# EAGLE design Adafruit AirLift Shield (EAGLE 9.3.2)
COMPANY: ADAFRUIT INDUSTRIES; DRAWN: KTOWN; REV: B
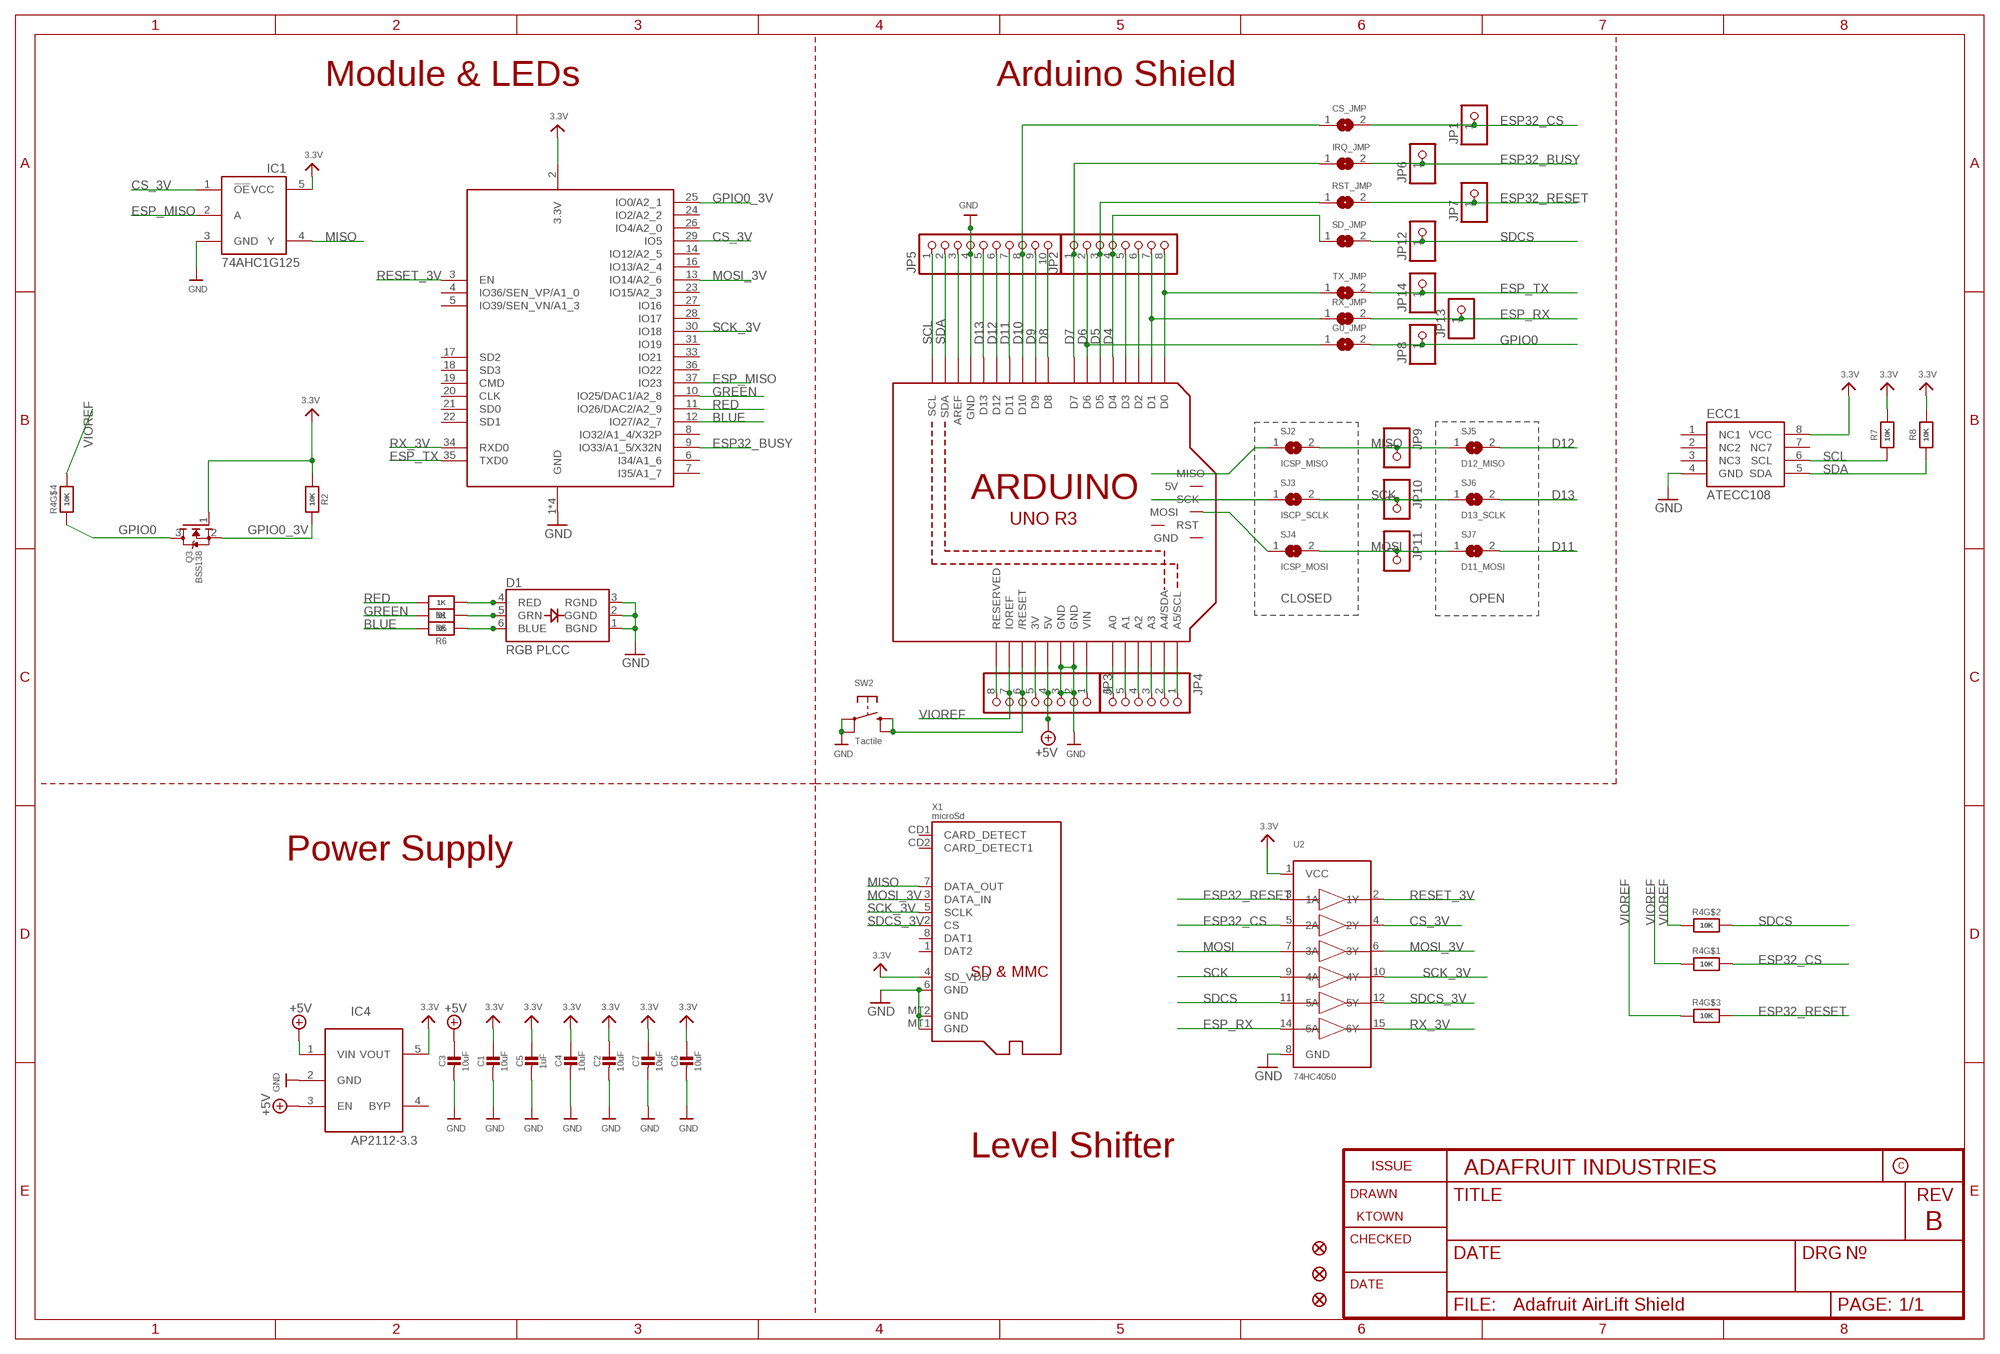
[diagram p0: schematic, sheet 1]

## Parts
C1  10uF  CAP_CERAMIC0805-NOOUTLINE  [0805-NO]
C2  10uF  CAP_CERAMIC0805-NOOUTLINE  [0805-NO]
C3  10uF  CAP_CERAMIC0805-NOOUTLINE  [0805-NO]
C4  10uF  CAP_CERAMIC0805-NOOUTLINE  [0805-NO]
C5  1uF  CAP_CERAMIC0805-NOOUTLINE  [0805-NO]
C6  10uF  CAP_CERAMIC0805-NOOUTLINE  [0805-NO]
C7  10uF  CAP_CERAMIC0805-NOOUTLINE  [0805-NO]
CS_JMP  SOLDERJUMPERCLOSED  [SOLDERJUMPER_CLOSEDWIRE]
D1  RGB PLCC  LED_RGB_PLCC6_3535  [RGBLED_3535_PLCC6]
ECC1  ATECC108  [SOIC8]
FID1  FIDUCIAL_1MM  [FIDUCIAL_1MM]
FID2  FIDUCIAL_1MM  [FIDUCIAL_1MM]
FID3  FIDUCIAL_1MM  [FIDUCIAL_1MM]
G0_JMP  SOLDERJUMPER  [SOLDERJUMPER_ARROW_NOPASTE]
IC1  74AHC1G125  [SOT23-5L]
IC4  AP2112-3.3  LP298XS  [SOT23-5L]
IRQ_JMP  SOLDERJUMPERCLOSED  [SOLDERJUMPER_CLOSEDWIRE]
JP1  HEADER-1X1ROUND  [1X01_ROUND]
JP2  HEADER-1X870MIL  [1X08_ROUND_70]
JP3  HEADER-1X870MIL  [1X08_ROUND_70]
JP4  HEADER-1X670MIL  [1X06_ROUND_70]
JP5  HEADER-1X1070MIL  [1X10_ROUND70]
JP6  HEADER-1X1ROUND  [1X01_ROUND]
JP7  HEADER-1X1ROUND  [1X01_ROUND]
JP8  HEADER-1X1ROUND  [1X01_ROUND]
JP9  HEADER-1X1ROUND  [1X01_ROUND]
JP10  HEADER-1X1ROUND  [1X01_ROUND]
JP11  HEADER-1X1ROUND  [1X01_ROUND]
JP12  HEADER-1X1ROUND  [1X01_ROUND]
JP13  HEADER-1X1ROUND  [1X01_ROUND]
JP14  HEADER-1X1ROUND  [1X01_ROUND]
M1  ARDUINO_R3_ICSP_NODIM  [ARDUINOR3_ICSP_NODIM]
Q3  BSS138  MOSFET-NWIDE  [SOT23-WIDE]
R1  1K  RESISTOR_0603_NOOUT  [0603-NO]
R2  10K  RESISTOR_0603_NOOUT  [0603-NO]
R4  10K  RESISTOR_4PACK  [RESPACK_4X0603]
R5  1K  RESISTOR_0603_NOOUT  [0603-NO]
R6  1K  RESISTOR_0603_NOOUT  [0603-NO]
R7  10K  RESISTOR_0603_NOOUT  [0603-NO]
R8  10K  RESISTOR_0603_NOOUT  [0603-NO]
RST_JMP  SOLDERJUMPERCLOSED  [SOLDERJUMPER_CLOSEDWIRE]
RX_JMP  SOLDERJUMPER  [SOLDERJUMPER_ARROW_NOPASTE]
SD_JMP  SOLDERJUMPERCLOSED  [SOLDERJUMPER_CLOSEDWIRE]
SJ2  ICSP_MISO  SOLDERJUMPERCLOSED  [SOLDERJUMPER_CLOSEDWIRE]
SJ3  ISCP_SCLK  SOLDERJUMPERCLOSED  [SOLDERJUMPER_CLOSEDWIRE]
SJ4  ICSP_MOSI  SOLDERJUMPERCLOSED  [SOLDERJUMPER_CLOSEDWIRE]
SJ5  D12_MISO  SOLDERJUMPERREFLOW_NOPASTE  [SOLDERJUMPER_REFLOW_NOPASTE]
SJ6  D13_SCLK  SOLDERJUMPERREFLOW_NOPASTE  [SOLDERJUMPER_REFLOW_NOPASTE]
SJ7  D11_MOSI  SOLDERJUMPERREFLOW_NOPASTE  [SOLDERJUMPER_REFLOW_NOPASTE]
SW2  Tactile  SWITCH_TACT_SMT_EVQQ2_SMALL  [EVQ-Q2_SMALLER]
TX_JMP  SOLDERJUMPER  [SOLDERJUMPER_ARROW_NOPASTE]
U2  74HC4050  74HC4050D  [SOIC16]
X1  microSd  MICROSD  [MICROSD]
X2  ESP32_WROOM32  [WROOM32]

## Nets
3.3V: C1.1 C2.1 C4.1 C5.1 C6.1 C7.1 ECC1.8(VCC) IC1.5(VCC) IC4.5(VOUT) Q3.1(G) R2.1 R7.2 R8.2 U2.1(VCC) X1.4(SD_VDD) X2.2(3.3V)
+3V: JP3.5 M1.3V
+5V: C3.1 IC4.1(VIN) IC4.3(EN) JP3.4 M1.5V
A0: JP4.6 M1.A0
A1: JP4.5 M1.A1
A2: JP4.4 M1.A2
A3: JP4.3 M1.A3
A4: JP4.2 M1.A4(A4/SDA)
A5: JP4.1 M1.A5(A5/SCL)
AREF: JP5.3 M1.AREF
BLUE: R6.2 X2.12(IO27/A2_7)
CS_3V: IC1.1(!OE) U2.4(2Y) X2.29(IO5)
D0: JP2.8 M1.D0 TX_JMP.1
D1: JP2.7 M1.D1 RX_JMP.1
D2: JP2.6 M1.D2
D3: JP2.5 M1.D3
D4: JP2.4 M1.D4 SD_JMP.1
D5: JP2.3 M1.D5 RST_JMP.1
D6: G0_JMP.1 JP2.2 M1.D6
D7: IRQ_JMP.1 JP2.1 M1.D7
D8: JP5.10 M1.D8
D9: JP5.9 M1.D9
D10: CS_JMP.1 JP5.8 M1.D10
D11: JP5.7 M1.D11 SJ7.2
D12: JP5.6 M1.D12 SJ5.2
D13: JP5.5 M1.D13 SJ6.2
ESP32_BUSY: IRQ_JMP.2 JP6.1 X2.9(IO33/A1_5/X32N)
ESP32_CS: CS_JMP.2 JP1.1 R4.8 U2.5(2A)
ESP32_RESET: JP7.1 R4.6 RST_JMP.2 U2.3(1A)
ESP_MISO: IC1.2(A) X2.37(IO23)
ESP_RX: JP13.1 RX_JMP.2 U2.14(6A)
ESP_TX: JP14.1 TX_JMP.2 X2.35(TXD0)
GND: C1.2 C2.2 C3.2 C4.2 C5.2 C6.2 C7.2 D1.1(BGND) D1.2(GGND) D1.3(RGND) ECC1.4(GND) IC1.3(GND) IC4.2(GND) JP3.2 JP3.3 JP5.4 M1.GND M1.GND@1(GND) M1.GND@3(GND) SW2.A'(P1) SW2.A(P) U2.8(GND) X1.6(GND) X1.MT1(GND) X1.MT2(GND) X2.1(GND) X2.15(GND) X2.38(GND) X2.P$1(GND)
GPIO0: G0_JMP.2 JP8.1 Q3.3(D) R4.4
GPIO0_3V: Q3.2(S) R2.2 X2.25(IO0/A2_1)
GREEN: R5.2 X2.10(IO25/DAC1/A2_8)
MISO: IC1.4(Y) JP9.1 SJ2.2 SJ5.1 X1.7(DATA_OUT)
MISO_ICSP: M1.MISO SJ2.1
MOSI: JP11.1 SJ4.2 SJ7.1 U2.7(3A)
MOSI_3V: U2.6(3Y) X1.3(DATA_IN) X2.13(IO14/A2_6)
MOSI_ICSP: M1.MOSI SJ4.1
N$8: D1.4(RED) R1.1
N$11: D1.5(GRN) R5.1
N$14: D1.6(BLUE) R6.1
NC: JP3.8 M1.RESERVED
RED: R1.2 X2.11(IO26/DAC2/A2_9)
RESET: JP3.6 M1.RESET(/RESET) SW2.B'(S1) SW2.B(S)
RESET_3V: U2.2(1Y) X2.3(EN)
RX_3V: U2.15(6Y) X2.34(RXD0)
SCK: JP10.1 SJ3.2 SJ6.1 U2.9(4A)
SCK_3V: U2.10(4Y) X1.5(SCLK) X2.30(IO18)
SCK_ICSP: M1.SCK SJ3.1
SCL: ECC1.6(SCL) JP5.1 M1.SCL R7.1
SDA: ECC1.5(SDA) JP5.2 M1.SDA R8.1
SDCS: JP12.1 R4.7 SD_JMP.2 U2.11(5A)
SDCS_3V: U2.12(5Y) X1.2(CS)
VIN: JP3.1 M1.VIN
VIOREF: JP3.7 M1.IOREF R4.1 R4.2 R4.3 R4.5
Unconnected: ECC1.1(NC1) ECC1.2(NC2) ECC1.3(NC3) ECC1.7(NC7) IC4.4(BYP) M1.5V_ICSP(5V) M1.GND@2(GND) M1.RESET_ICSP(RST) X1.1(DAT2) X1.8(DAT1) X1.CD1(CARD_DETECT) X1.CD2(CARD_DETECT1) X2.4(IO36/SEN_VP/A1_0) X2.5(IO39/SEN_VN/A1_3) X2.6(I34/A1_6) X2.7(I35/A1_7) X2.8(IO32/A1_4/X32P) X2.14(IO12/A2_5) X2.16(IO13/A2_4) X2.17(SD2) X2.18(SD3) X2.19(CMD) X2.20(CLK) X2.21(SD0) X2.22(SD1) X2.23(IO15/A2_3) X2.24(IO2/A2_2) X2.26(IO4/A2_0) X2.27(IO16) X2.28(IO17) X2.31(IO19) X2.33(IO21) X2.36(IO22)

## Notes on the sheet
- Module & LEDs | Arduino Shield
- CLOSED | OPEN
- Power Supply
- Level Shifter

## Library data of the parts
C1-C7 = microbuilder:CAP_CERAMIC: Ceramic Capacitors For new designs, use the packages preceded by an '_' character since they are more reliable: The following footprints should be used on most boards: _0402 - Standard footprint for regular board layouts _0603 - Standard footprint for regular board layouts _0805 - Standard footprint for regular board layouts _1206 - Standard footprint for regular board layouts For extremely tight-pitch boards where space is at a premium, the following 'micro-pitch' footprints can be used (smaller pads, no silkscreen outline, etc.): _0402MP - Micro-pitch footprint for very dense/compact boards _0603MP - Micro-pitch footprint for very dense/compact boards _0805MP - Micro-pitch footprint for very dense/compact boards _1206MP - Micro-pitch footprint for very dense/compact boards
CS_JMP IRQ_JMP RST_JMP SD_JMP SJ2-SJ7 = microbuilder:SOLDERJUMPER: SMD Solder JUMPER Solder the two pads together to create a connection, or remove the solder to break it. REFLOW - Use this footprint for solder paste and reflow ovens. WAVE - Use this footprint for hand-soldering (larger pads). CLOSED - Has a trace between the two pads to ensure it is closed by default. The trace needs to be cut to disable the jumper, and can be closed again by creating a solder bridge between the two pads.
D1 = microbuilder:LED_RGB_PLCC6: RGB LED Cree CLV6A-FKB - Digikey: CLV6A-FKB-CK1P1G1BB7R3R3TR-ND DC Foreward Current: 20mA Foreward Voltage: R = 2.0, G = 3.2, B = 3.2 Viewing Angle: 120°
ECC1 = cryptotronix:ATECC108: ATECC108: Provides ECDSA with NIST curves P256, B283, and K283. Also, a RNG, 8.5Kb EEPROM. 2.0V - 5.5V.
FID1-FID3 = microbuilder:FIDUCIAL: Fiducial Alignment Points Various fiducial points for machine vision alignment.; BOM: EXCLUDE
G0_JMP RX_JMP TX_JMP = microbuilder:SOLDERJUMPER: SMD Solder JUMPER Solder the two pads together to create a connection, or remove the solder to break it. REFLOW - Use this footprint for solder paste and reflow ovens. WAVE - Use this footprint for hand-soldering (larger pads). CLOSED - Has a trace between the two pads to ensure it is closed by default. The trace needs to be cut to disable the jumper, and can be closed again by creating a solder bridge between the two pads.; BOM: EXCLUDE
IC1 = adafruit:74AHC1G125
IC4 = adafruit:LP298X
JP1 JP6-JP14 = microbuilder:HEADER-1X1: PIN HEADER
JP2 JP3 = microbuilder:HEADER-1X8: PIN HEADER
JP4 = microbuilder:HEADER-1X6: PIN HEADER
JP5 = microbuilder:HEADER-1X10: PIN HEADER
M1 = adafruit:ARDUINO_R3_ICSP
Q3 = microbuilder:MOSFET-N: N-Channel Mosfet LEGEND VDS: Voltage Drain-Source ID: Drain Current RDS(ON): Drain-Source On-State Resistance VGS(TH): Gate-Source Threshold Voltage CISS: Drain-Source Input Capacitance SOT-23 Name VDS ID RDS(ON) VGS(TH) CISS Order Number 2N7002E 60V 260mA 2.5 Ohm 2.5V @ 250uA 26.7pF @ 25V 2N7002ET1GOSTR-ND BSH103 30V 850mA 400 mOhm 400mV @ 1mA 83pF @ 24V BSH103,235-ND BSS138 60V 320mA 1.6 Ohm 1.5V @ 250uA 50pF @ 10V Mouser: 771-BSS138PW115 DMN2075U-7 20V 4.2A 38 mOhm 1V @ 250 uA 594.3pF @ 10V DMN2075U-7DICT-ND * BSS138 good choice for I2C level-shifting POWERPAK 1212-8 Name VDS ID RDS(ON) VGS(TH) CISS Order Number Si7308DN 60V 6A 58 mOhm 3V @ 250uA 665pF @ 15V SI7308DN-T1-E3CT-ND
R1 R2 R5-R8 = microbuilder:RESISTOR: Resistors For new designs, use the packages preceded by an '_' character since they are more reliable: The following footprints should be used on most boards: _0402 - Standard footprint for regular board layouts _0603 - Standard footprint for regular board layouts _0805 - Standard footprint for regular board layouts _1206 - Standard footprint for regular board layouts For extremely tight-pitch boards where space is at a premium, the following 'micro-pitch' footprints can be used (smaller pads, no silkscreen outline, etc.): _0402MP - Micro-pitch footprint for very dense/compact boards _0603MP - Micro-pitch footprint for very dense/compact boards _0805MP - Micro-pitch footprint for very dense/compact boards _1206MP - Micro-pitch footprint for very dense/compact boards
R4 = microbuilder:RESISTOR_4PACK: Resistor Packs (4 resistors) 4 x 0603 10K 1/16W - Digikey: YC164J-10KCT-ND
SW2 = microbuilder:SWITCH_TACT_SMT: SMT Tact Switches 6x6mm - Digikey: P12940SCT-ND KMR2 (4.6x2.8mm) - Digikey: 401-1426-1-ND EVQ-PQHB55 - Light Touch, 160GF (4.5x4.5mm) - Digikey: P8090SCT-ND KMT0 - KMT021 NGJ LHS (etc.) IP68/Waterproof - Digikey: CKN10289CT-ND
U2 = microbuilder:74HC4050D: 6-channel level shifter 74HC4050D - 2V-6V Supply SOIC16 Digikey: 74HC4050D,653-ND Mouser: 771-74HC4050D-T TSSOP16 Digikey: 296-9215-1-ND Mouser:
X1 = microbuilder:MICROSD: MicroSD/Transflash Card Holder with SPI pinout 3M: 2908-05WB-MG 4UConnector: 19656 Footprint courtesy: Adafruit Industries
X2 = microbuilder:ESP32_WROOM32

## Board
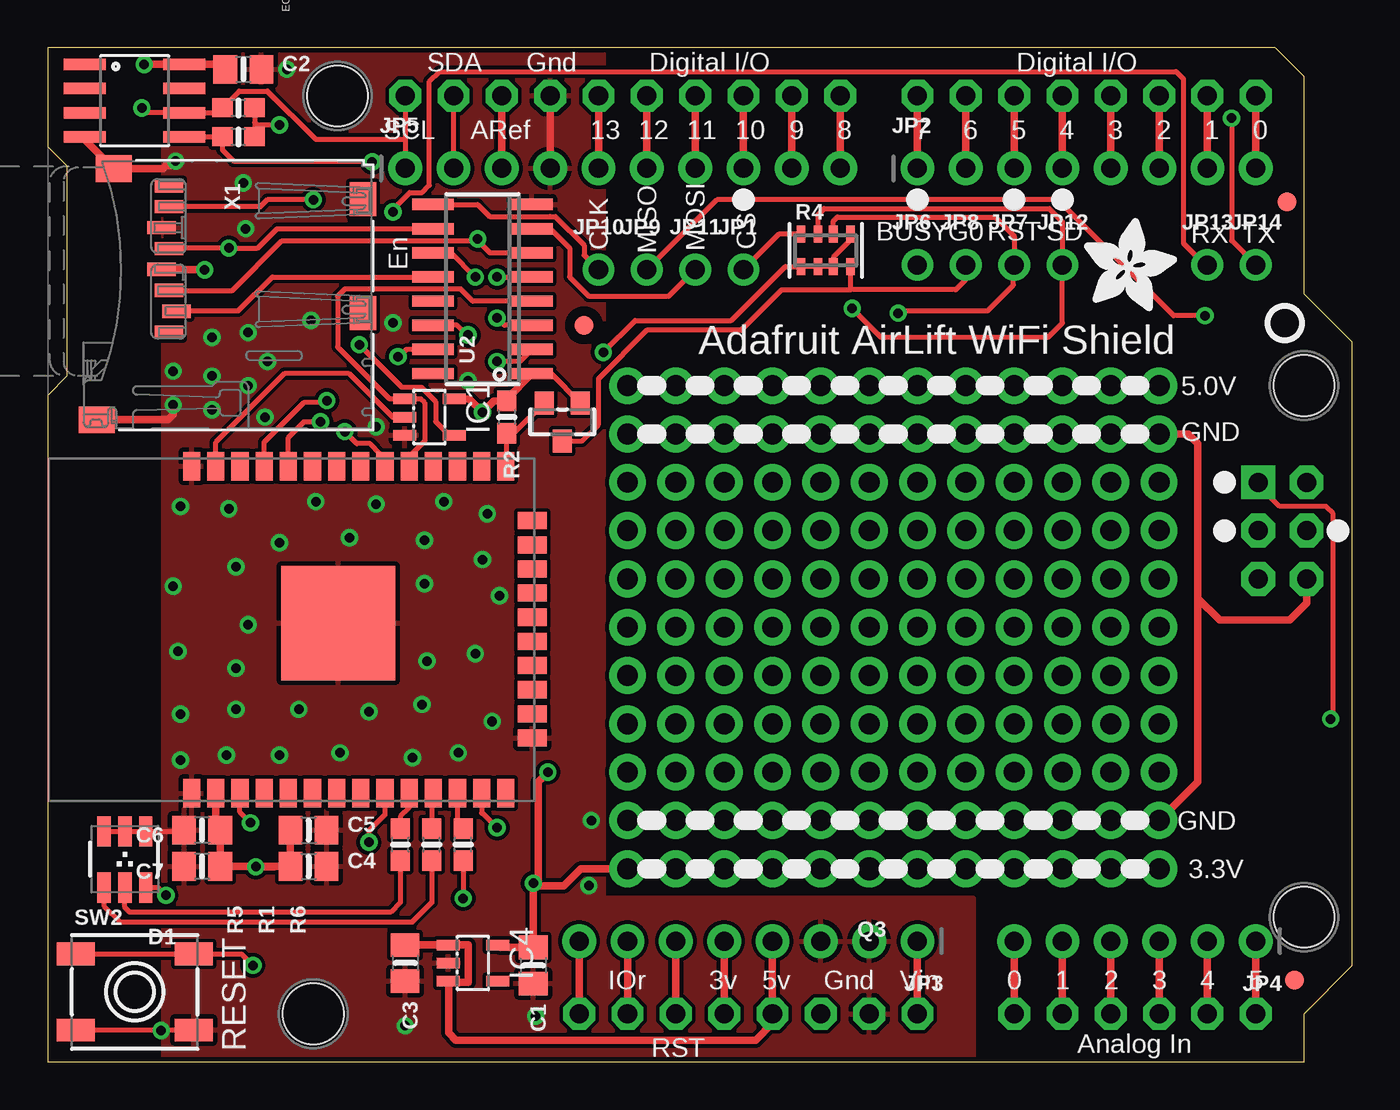
[diagram p1: board, top side]
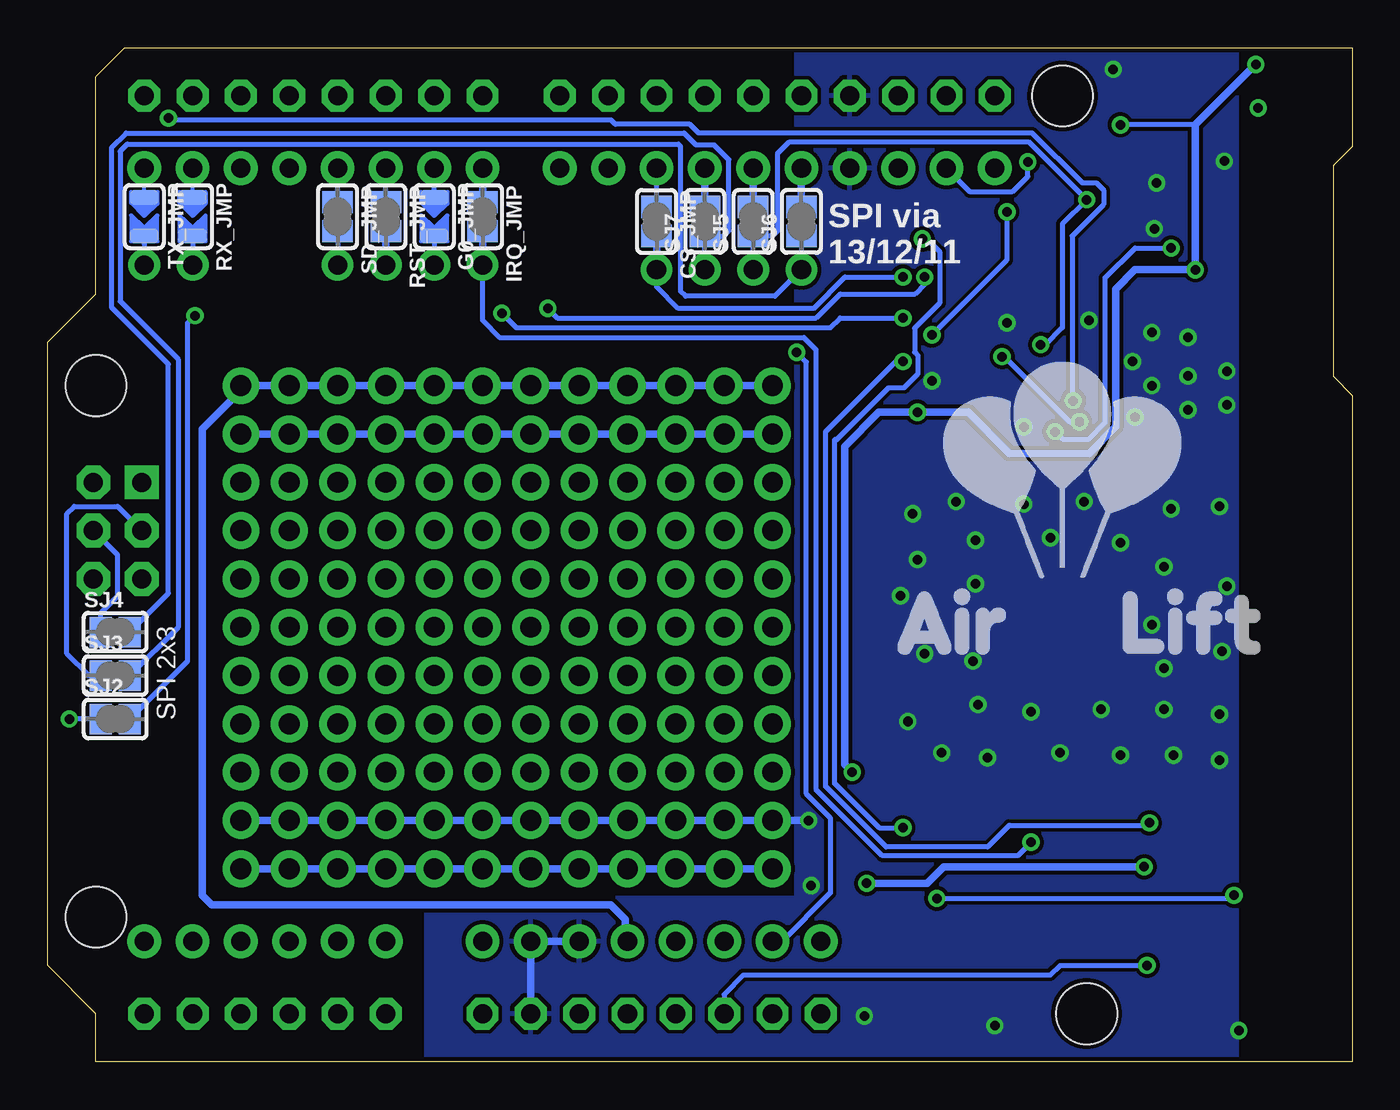
[diagram p2: board, bottom side, seen from below]

Size 68.58 x 53.34 mm. Coordinates in mm from the lower left corner, seen from the top.
Outline: 0,0 66.04,0 66.04,2.54 68.58,5.08 68.58,37.85 66.04,40.39 66.04,51.82 64.52,53.34 0,53.34 0,48.13 1.02,47.12 1.02,36.07 0,35.05 0,0
Copper layers (1*16): Top 0.035mm / dielectric 1.5mm / Bottom 0.035mm
Design rules "adafruit *": minimum track width 8mil, minimum drill 15.5mil, track to track 8mil, track to pad 8mil, pad to pad 8mil, via to via 8mil, smd to smd 8mil, copper to edge 10mil, drill to drill 8mil, minimum pad ring 10mil, minimum via ring 8mil, stop-mask expansion 2mil, vias tented up to drill 20mil, thermal gap 10mil
Holes 3.2 mm at 13.97,2.54 66.04,35.56 66.04,7.62 15.24,50.8

### Footprints (pad centres in the part's own frame; a part is rotated, then mirrored left to right if it is on the bottom)
0805-NO = smd 1.24 x 1.5: 1 -0.95,0; 2 0.95,0
SOLDERJUMPER_CLOSEDWIRE = smd 1.168 x 1.6: 1 -0.762,0; 2 0.762,0 | smd 0.635 x 0.203: WIRE 0,0
RGBLED_3535_PLCC6 = smd 0.7 x 1.6: 1 -1.1,-1.458; 2 0,-1.458; 3 1.1,-1.458; 4 1.1,1.508; 5 0,1.508; 6 -1.1,1.508
SOIC8 = smd 0.61 x 2.21: 1 -1.905,-2.616; 2 -0.635,-2.616; 3 0.635,-2.616; 4 1.905,-2.616; 5 1.905,2.616; 6 0.635,2.616; 7 -0.635,2.616; 8 -1.905,2.616
FIDUCIAL_1MM = smd 1 x 1: 1 0,0
SOLDERJUMPER_ARROW_NOPASTE = smd 0.762 x 1.524: 1 -1.016,0; 2 1.016,0
SOT23-5L = smd 0.55 x 1.2: 1 -0.95,-1.3; 2 0,-1.3; 3 0.95,-1.3; 4 0.95,1.3; 5 -0.95,1.3
1X01_ROUND = drill 1 pad 1.676: 1 0,0
1X08_ROUND_70 = drill 1 pad 1.778: 1 -8.89,0; 2 -6.35,0; 3 -3.81,0; 4 -1.27,0; 5 1.27,0; 6 3.81,0; 7 6.35,0; 8 8.89,0
1X06_ROUND_70 = drill 1 pad 1.778: 1 -6.35,0; 2 -3.81,0; 3 -1.27,0; 4 1.27,0; 5 3.81,0; 6 6.35,0
1X10_ROUND70 = drill 1 pad 1.778: 1 -11.43,0; 2 -8.89,0; 3 -6.35,0; 4 -3.81,0; 5 -1.27,0; 6 1.27,0; 7 3.81,0; 8 6.35,0; 9 8.89,0; 10 11.43,0
ARDUINOR3_ICSP_NODIM = drill 1 pad 1.676 octagon: 3V 35.56,2.54; 5V 38.1,2.54; A0 50.8,2.54; A1 53.34,2.54; A2 55.88,2.54; A3 58.42,2.54; A4 60.96,2.54; A5 63.5,2.54; AREF 23.876,50.8; D0 63.5,50.8; D1 60.96,50.8; D2 58.42,50.8; D3 55.88,50.8; D4 53.34,50.8; D5 50.8,50.8; D6 48.26,50.8; D7 45.72,50.8; D8 41.656,50.8; D9 39.116,50.8; D10 36.576,50.8; D11 34.036,50.8; D12 31.496,50.8; D13 28.956,50.8; GND 26.416,50.8; GND@1 43.18,2.54; GND@2 40.64,2.54; IOREF 30.48,2.54; RESERVED 27.94,2.54; RESET 33.02,2.54; SCL 18.796,50.8; SDA 21.336,50.8; VIN 45.72,2.54 | drill 1 pad 1.778 octagon: 5V_ICSP 66.167,30.48; GND@3 66.167,25.4; MOSI 66.167,27.94; RESET_ICSP 63.627,25.4; SCK 63.627,27.94 | drill 1 pad 1.778 square: MISO 63.627,30.48
SOT23-WIDE = smd 1 x 1.2: 1 -0.95,-1; 2 0.95,-1; 3 0,1
0603-NO = smd 1.075 x 1: 1 -0.85,0; 2 0.85,0
RESPACK_4X0603 = smd 0.45 x 0.9: 1 -1.3,-0.85; 2 -0.4,-0.85; 3 0.4,-0.85; 4 1.3,-0.85; 5 1.3,0.85; 6 0.4,0.85; 7 -0.4,0.85; 8 -1.3,0.85
SOLDERJUMPER_REFLOW_NOPASTE = smd 1.168 x 1.6: 1 -0.762,0; 2 0.762,0
EVQ-Q2_SMALLER = smd 2 x 1.2: A -3.1,-2; A' 3.1,-2; B -3.1,2; B' 3.1,2
SOIC16 = smd 0.6 x 2.2: 1 -4.445,-2.6; 2 -3.175,-2.6; 3 -1.905,-2.6; 4 -0.635,-2.6; 5 0.635,-2.6; 6 1.905,-2.6; 7 3.175,-2.6; 8 4.445,-2.6; 9 4.445,2.6; 10 3.175,2.6; 11 1.905,2.6; 12 0.635,2.6; 13 -0.635,2.6; 14 -1.905,2.6; 15 -3.175,2.6; 16 -4.445,2.6
MICROSD = smd 0.7 x 1.5: 1 9,-10.64; 2 7.9,-10.24; 3 6.8,-10.64; 4 5.7,-11.04; 5 4.6,-10.64; 6 3.5,-11.04; 7 2.4,-10.64; 8 1.3,-10.64 | smd 1.8 x 1.4: CD1 2,-0.44; CD2 8,-0.44 | smd 1.4 x 1.9: MT1 0.4,-13.54; MT2 13.6,-14.44
WROOM32 = smd 1.5 x 0.9: 1 -8.6,5; 2 -8.6,3.73; 3 -8.6,2.46; 4 -8.6,1.19; 5 -8.6,-0.08; 6 -8.6,-1.35; 7 -8.6,-2.62; 8 -8.6,-3.89; 9 -8.6,-5.16; 10 -8.6,-6.43; 11 -8.6,-7.7; 12 -8.6,-8.97; 13 -8.6,-10.24; 14 -8.6,-11.51; 25 8.6,-11.51; 26 8.6,-10.24; 27 8.6,-8.97; 28 8.6,-7.7; 29 8.6,-6.43; 30 8.6,-5.16; 31 8.6,-3.89; 32 8.6,-2.62; 33 8.6,-1.35; 34 8.6,-0.08; 35 8.6,1.19; 36 8.6,2.46; 37 8.6,3.73; 38 8.6,5 | smd 0.9 x 1.5: 15 -5.7,-12.9; 16 -4.43,-12.9; 17 -3.16,-12.9; 18 -1.89,-12.9; 19 -0.62,-12.9; 20 0.65,-12.9; 21 1.92,-12.9; 22 3.19,-12.9; 23 4.46,-12.9; 24 5.73,-12.9 | smd 6 x 6: P$1 0.34,-2.7

### Placement (x,y rotation side)
C1  25.53,5.08 270 top
C2  10.29,52.2 0 top
C3  18.8,5.21 270 top
C4  13.72,10.29 0 top
C5  13.72,12.19 0 top
C6  8.13,12.19 180 top
C7  8.13,10.29 180 top
CS_JMP  36.58,44.2 270 bottom
D1  4.06,10.67 180 top
ECC1  4.57,50.55 270 top
FID1  65.15,45.21 0 top
FID2  65.53,4.32 0 top
FID3  28.19,38.73 0 top
G0_JMP  48.26,44.45 270 bottom
IC1  20.07,33.91 270 top
IC4  22.35,5.21 270 top
IRQ_JMP  45.72,44.45 270 bottom
JP1  36.58,41.66 0 top
JP2  54.61,46.99 0 top
JP3  36.83,6.35 180 top
JP4  57.15,6.35 180 top
JP5  30.23,46.99 0 top
JP6  45.72,41.91 0 top
JP7  50.8,41.91 0 top
JP8  48.26,41.91 0 top
JP9  31.5,41.66 0 top
JP10  28.96,41.66 0 top
JP11  34.04,41.66 0 top
JP12  53.34,41.91 0 top
JP13  60.96,41.91 0 top
JP14  63.5,41.91 0 top
M1  0,0 0 top
Q3  27.05,33.66 180 top
R1  20.19,11.43 90 top
R2  24.13,33.91 270 top
R4  40.89,42.67 0 top
R5  18.54,11.43 90 top
R6  21.84,11.43 90 top
R7  10.03,50.16 0 top
R8  10.03,48.64 0 top
RST_JMP  50.8,44.45 270 bottom
RX_JMP  60.96,44.45 270 bottom
SD_JMP  53.34,44.45 270 bottom
SJ2  65.02,18.03 0 bottom
SJ3  65.02,20.32 0 bottom
SJ4  65.02,22.61 0 bottom
SJ5  31.5,44.2 90 bottom
SJ6  28.96,44.2 90 bottom
SJ7  34.04,44.2 90 bottom
SW2  4.57,3.68 0 top
TX_JMP  63.5,44.45 270 bottom
U2  22.86,40.64 90 top
U$9  [ADAFRUIT_5MM]  54.48,39.5 0 top
U$21  [PCBFEAT-REV-040]  65.02,38.86 0 top
U$23  [AIRLIFT]  23.88,20.07 0 bottom
X1  17.02,47.37 270 top
X2  12.57,22.73 90 top

### Tracks (layer width: path | path; a pad name or v marks a point on that pad's centre or on a via)
3.3V  (via drill 0.5, 1.1 pad 1.93, 1.2 pad 1.93)
  Top 0.254: Q3.1 26.46,36.2 U2.1 | R7.2 10.88,49.4 | 10.88,49.4 R8.2 | 10.88,49.4 11.01,49.28 v12.19,49.28
  Top 0.406: X1.4 8.24,41.67 v8.26,41.66 | IC4.5 23.78,6.03 C1.1 25.53,9.27 | 25.78,9.27 27.12,9.27 28.02,10.16 v30.48,10.16 | 25.78,9.27 25.53,9.27 | 25.53,9.27 v25.53,9.4 | X2.2 8.84,12.43 C6.1 C7.1 11.94,10.29 | 11.94,10.29 12.57,10.29 | 12.57,10.29 C4.1 | v26.29,15.24 25.78,14.73 25.78,9.27 | C5.1 12.77,10.48 12.57,10.29 | v10.95,10.26 11.91,10.26 11.94,10.29 | IC1.5 22.16,34.86 v22.86,34.16 23.46,34.76 R2.1 24.13,34.87 U2.1 | C2.1 9.08,52.45 ECC1.8 v5.08,52.45
  Bottom 0.254: 8.26,49.28 v12.19,49.28
  Bottom 0.406: v58.42,10.16 v55.88,10.16 v53.34,10.16 v50.8,10.16 v48.26,10.16 v45.72,10.16 v43.18,10.16 v40.64,10.16 v38.1,10.16 v35.56,10.16 v33.02,10.16 v30.48,10.16 | v10.95,10.26 21.49,10.26 22.35,9.4 v25.53,9.4 | v26.29,15.24 26.7,15.65 26.7,32.37 24.9,34.16 v22.86,34.16 20.19,34.16 18.03,32 13.84,32 12.45,33.4 12.45,40.64 11.43,41.66 v8.26,41.66 8.26,49.28 v5.08,52.45
+3V
  Top 0.406: M1.3V JP3.5
+5V  (via drill 1.1 pad 1.93)
  Top 0.406: JP3.4 M1.5V 38.1,2.03 37.21,1.14 21.46,1.14 21.08,1.52 21.08,4.26 IC4.3 21.05,4.19 22.1,4.19 22.1,6.16 IC4.1 C3.1
  Bottom 0.406: v58.42,35.56 58.17,35.56 | 58.17,35.56 v55.88,35.56 v53.34,35.56 v50.8,35.56 v48.26,35.56 v45.72,35.56 v43.18,35.56 v40.64,35.56 v38.1,35.56 v35.56,35.56 v33.02,35.56 v30.48,35.56 | 58.17,35.56 60.45,33.27 60.45,8.76 59.94,8.26 38.99,8.26 38.23,7.49 38.23,6.48 JP3.4
A0
  Top 0.406: JP4.6 M1.A0
A1
  Top 0.406: JP4.5 M1.A1
A2
  Top 0.406: JP4.4 M1.A2
A3
  Top 0.406: JP4.3 M1.A3
A4
  Top 0.406: JP4.2 M1.A4
A5
  Top 0.406: M1.A5 JP4.1
AREF
  Top 0.406: JP5.3 M1.AREF
BLUE
  Top 0.254: X2.12 21.54,12.58 R6.2
CS_3V
  Top 0.254: X2.29 19,31.83 19.81,32.64 19.81,34.67 19.62,34.86 IC1.1 17.97,34.86 15.24,37.59 15.24,40.26 15.62,40.64 21.72,40.64 22.35,40.01 U2.4
D0
  Top 0.406: M1.D0 JP2.8
  Bottom 0.203: TX_JMP.1 JP2.8
D1
  Top 0.406: M1.D1 JP2.7
  Bottom 0.203: RX_JMP.1 JP2.7
D2
  Top 0.406: M1.D2 JP2.6
D3
  Top 0.406: M1.D3 JP2.5
D4
  Top 0.406: M1.D4 JP2.4
  Bottom 0.254: SD_JMP.1 JP2.4
D5
  Top 0.406: M1.D5 JP2.3
  Bottom 0.254: RST_JMP.1 JP2.3
D6
  Top 0.406: M1.D6 JP2.2
  Bottom 0.254: G0_JMP.1 JP2.2
D7
  Top 0.406: M1.D7 JP2.1
  Bottom 0.406: JP2.1 IRQ_JMP.1
D8
  Top 0.406: M1.D8 JP5.10
D9
  Top 0.406: M1.D9 JP5.9
D10
  Top 0.406: M1.D10 JP5.8
  Bottom 0.254: CS_JMP.1 JP5.8
D11
  Top 0.406: M1.D11 JP5.7
  Bottom 0.406: JP5.7 SJ7.2
D12
  Top 0.406: M1.D12 JP5.6
  Bottom 0.406: JP5.6 SJ5.2
D13
  Top 0.406: M1.D13 JP5.5
  Bottom 0.406: JP5.5 SJ6.2
ESP32_BUSY  (via drill 0.5)
  Top 0.254: X2.9 17.73,12.99 16.89,12.15 v16.89,11.56
  Bottom 0.254: JP6.1 45.72,38.99 44.83,38.1 28.83,38.1 28.19,37.47 28.19,14.34 24.7,10.85 17.6,10.85 v16.89,11.56
  Bottom 0.406: IRQ_JMP.2 JP6.1
ESP32_CS  (via drill 0.5)
  Top 0.254: v23.62,41.27 U2.5 | R4.8 38.44,43.52 JP1.1
  Bottom 0.254: v23.62,41.27 26.67,41.27 28.32,39.62 35.43,39.62 36.58,40.77 JP1.1
  Bottom 0.406: CS_JMP.2 JP1.1
ESP32_RESET  (via drill 0.5)
  Top 0.254: U2.3 24,38.73 v23.62,39.12 | v44.7,39.37 44.83,39.5 49.4,39.5 50.76,40.85 50.76,41.83 50.74,41.85 JP7.1 50.8,43.43 49.81,44.42 41.5,44.42 41.29,44.22 R4.6
  Bottom 0.254: v44.7,39.37 43.94,38.61 27.43,38.61 26.92,39.12 v23.62,39.12
  Bottom 0.406: RST_JMP.2 JP7.1
ESP_MISO
  Top 0.254: X2.37 8.84,32.59 12.45,36.2 15.85,36.2 18.13,33.91 IC1.2
ESP_RX  (via drill 0.5)
  Top 0.254: v22.1,38.23 22.04,38.23 21.53,38.73 U2.14 | v18.16,44.7 18.16,44.85 19.03,45.72 19.68,45.72 20.07,46.1 20.07,51.56 20.57,52.07 59.31,52.07 59.69,51.69 59.69,43.05 60.83,41.91 JP13.1
  Bottom 0.254: v18.16,44.7 18.16,42.16 v22.1,38.23 | RX_JMP.2 JP13.1
ESP_TX  (via drill 0.5)
  Top 0.254: X2.35 11.38,32.59 13.46,34.67 14.57,34.67 v14.68,34.78 | v62.23,49.63 62.23,43.18 JP14.1
  Bottom 0.254: TX_JMP.2 63.5,43.05 63.5,42.56 JP14.1 | v14.68,34.78 14.73,34.83 14.73,43.43 13.08,45.09 13.08,45.85 13.46,46.23 14.21,46.23 16.83,48.84 34.37,48.84 34.82,49.3 38.73,49.3 38.96,49.53 62.23,49.53 v62.23,49.63
GND  (via drill 0.5, 1.1 pad 1.93)
  Top 0.254: SW2.A SW2.A' | D1.3 D1.2 D1.1 7.11,12.13 C6.2
  Top 0.406: M1.GND JP5.4 | v58.42,33.02 59.94,33.02 60.45,32.51 60.45,24.38 | 60.45,24.38 61.59,23.24 65.28,23.24 66.17,24.13 M1.GND@3 | v58.42,12.7 60.45,14.73 60.45,24.38 | X1.MT2 6.34,33.77 6.6,34.04 v6.6,34.54 | ECC1.4 1.96,48.49 X1.MT1 6.08,46.97 6.22,47.12 6.48,47.12 v6.73,47.37
  Bottom 0.406: v58.42,12.7 v55.88,12.7 v53.34,12.7 v50.8,12.7 v48.26,12.7 v45.72,12.7 v43.18,12.7 v40.64,12.7 v38.1,12.7 v35.56,12.7 v33.02,12.7 v30.48,12.7 28.7,12.7 | v58.42,33.02 v55.88,33.02 v53.34,33.02 v50.8,33.02 v48.26,33.02 v45.72,33.02 v43.18,33.02 v40.64,33.02 v38.1,33.02 v35.56,33.02 v33.02,33.02 v30.48,33.02 | JP3.3 JP3.2 M1.GND@1
  other vias: 28.57,12.7 10.41,43.81 5.97,1.65 18.8,1.91 25.65,2.41 10.54,35.56 11.56,36.83 8.64,34.29 6.6,36.32 8.64,36.07 8.64,38.1 10.54,38.35 6.99,15.88 28.45,9.27 17.27,33.4 6.99,18.29 6.86,21.59 6.6,25.02 10.54,22.99 6.99,29.21 9.53,29.08 9.91,26.04 9.91,20.7 9.91,18.54 9.4,16.13 12.19,16.13 13.21,18.54 15.37,16.26 16.89,18.41 19.18,16 19.68,18.8 21.59,16.26 23.37,17.91 22.48,21.46 19.94,21.08 23.75,24.51 19.81,25.15 22.86,26.42 19.81,27.43 23.11,28.83 20.83,29.46 17.27,29.34 15.88,27.56 14.1,29.46 12.19,27.3 10.29,46.23 12.57,52.2 22.1,35.81 18.16,38.86 11.43,33.91 13.84,38.99
  pour Top: 29.21,53.34 29.21,8.64 48.64,8.64 48.64,0 6.1,0 6.1,53.34
  pour Bottom: 6.1,53.34 6.1,0 48.64,0 48.64,8.64 29.21,8.64 29.21,53.34
GPIO0
  Top 0.254: Q3.3 28.08,32.66 28.96,33.53 28.96,35.94 31.5,38.48 36.45,38.48 38.58,40.61 42.19,40.61 | JP8.1 48.26,41.15 47.72,40.61 42.19,40.61 | R4.4 42.19,40.61
  Bottom 0.254: G0_JMP.2 JP8.1
GPIO0_3V
  Top 0.254: X2.25 24.13,31.38 R2.2 24.5,33.06 Q3.2
GREEN
  Top 0.254: X2.10 19,13.37 18.54,12.91 R5.2
MISO  (via drill 0.5)
  Top 0.254: X1.7 11.19,44.97 11.56,45.34 v13.97,45.34 | IC1.4 21.11,32.96 20.4,33.67 20.4,34.73 19.66,35.46 18.64,35.46 v16.38,37.72 | JP9.1 35.18,45.34 53.09,45.34 59.18,39.24 v60.83,39.24
  Bottom 0.254: SJ2.2 61.21,21.08 61.21,38.86 v60.83,39.24 | JP9.1 SJ5.1 30.48,43.43 30.23,43.69 30.23,47.75 29.59,48.39 17.02,48.39 v13.97,45.34 15.24,44.07 15.24,38.61 16.13,37.72 v16.38,37.72
MISO_ICSP  (via drill 0.5)
  Top 0.254: v67.44,18.03 67.56,18.16 67.56,28.83 67.18,29.21 64.77,29.21 63.63,30.35 M1.MISO
  Bottom 0.254: SJ2.1 v67.44,18.03
MOSI
  Top 0.254: U2.7 26.42,43.81 27.43,42.8 27.43,41.27 28.45,40.26 32.64,40.26 JP11.1
  Bottom 0.254: SJ4.2 62.23,24.64 62.23,36.69 65.23,39.69 65.23,48.07 64.45,48.84 35.13,48.84 34.49,48.21 33.53,48.21 32.77,47.44 32.77,43.69 33.02,43.43 SJ7.1 JP11.1
MOSI_3V  (via drill 0.5)
  Top 0.254: X1.3 9.71,40.57 12.32,43.18 22.61,43.18 | U2.6 23.24,42.55 22.61,43.18 | X2.13 22.81,13.08 22.86,13.08 v23.62,12.32 | v22.61,43.27 22.61,43.18
  Bottom 0.254: v23.62,12.32 24.88,12.32 27.23,14.67 27.23,32.72 27.1,32.72 24.36,35.46 23.56,35.46 22.84,36.18 22.84,37.15 23.01,37.32 23.01,38.59 21.7,39.9 21.7,42.62 22.28,43.2 22.53,43.2 v22.61,43.27
MOSI_ICSP
  Bottom 0.254: SJ4.1 65.79,23.62 64.9,24.51 64.9,26.67 M1.MOSI
N$2  (via drill 1.1 pad 1.93)
  other vias: 58.42,27.94
N$3  (via drill 1.1 pad 1.93)
  other vias: 58.42,25.4
N$4  (via drill 1.1 pad 1.93)
  other vias: 58.42,22.86
N$7  (via drill 1.1 pad 1.93)
  other vias: 58.42,20.32
N$8
  Top 0.254: R1.1 20.19,8.38 19.18,7.37 3.81,7.37 2.96,8.21 D1.4
N$9  (via drill 1.1 pad 1.93)
  other vias: 58.42,17.78
N$10  (via drill 1.1 pad 1.93)
  other vias: 43.18,27.94
N$11
  Top 0.254: R5.1 18.54,8.38 18.03,7.87 4.32,7.87 4.06,8.13 D1.5
N$12  (via drill 1.1 pad 1.93)
  other vias: 45.72,27.94
N$13  (via drill 1.1 pad 1.93)
  other vias: 48.26,27.94
N$14  (via drill 0.5)
  Top 0.254: R6.1 v21.84,8.6 | v6.22,8.76 5.83,9.16 D1.6
  Bottom 0.254: v21.84,8.6 6.39,8.6 v6.22,8.76
N$18  (via drill 1.1 pad 1.93)
  other vias: 33.02,25.4
N$19  (via drill 1.1 pad 1.93)
  other vias: 50.8,27.94
N$20  (via drill 1.1 pad 1.93)
  other vias: 53.34,27.94
N$21  (via drill 1.1 pad 1.93)
  other vias: 43.18,25.4
N$22  (via drill 1.1 pad 1.93)
  other vias: 45.72,25.4
N$23  (via drill 1.1 pad 1.93)
  other vias: 48.26,25.4
N$24  (via drill 1.1 pad 1.93)
  other vias: 58.42,30.48
N$25  (via drill 1.1 pad 1.93)
  other vias: 55.88,30.48
N$26  (via drill 1.1 pad 1.93)
  other vias: 50.8,25.4
N$27  (via drill 1.1 pad 1.93)
  other vias: 50.8,30.48
N$28  (via drill 1.1 pad 1.93)
  other vias: 48.26,30.48
N$29  (via drill 1.1 pad 1.93)
  other vias: 45.72,30.48
N$30  (via drill 1.1 pad 1.93)
  other vias: 43.18,30.48
N$31  (via drill 1.1 pad 1.93)
  other vias: 33.02,27.94
N$32  (via drill 1.1 pad 1.93)
  other vias: 30.48,27.94
N$33  (via drill 1.1 pad 1.93)
  other vias: 30.48,30.48
N$35  (via drill 1.1 pad 1.93)
  other vias: 33.02,30.48
N$36  (via drill 1.1 pad 1.93)
  other vias: 55.88,27.94
N$37  (via drill 1.1 pad 1.93)
  other vias: 53.34,25.4
N$38  (via drill 1.1 pad 1.93)
  other vias: 30.48,25.4
N$39  (via drill 1.1 pad 1.93)
  other vias: 30.48,22.86
N$40  (via drill 1.1 pad 1.93)
  other vias: 30.48,20.32
N$41  (via drill 1.1 pad 1.93)
  other vias: 30.48,17.78
N$42  (via drill 1.1 pad 1.93)
  other vias: 30.48,15.24
N$50  (via drill 1.1 pad 1.93)
  other vias: 55.88,25.4
N$51  (via drill 1.1 pad 1.93)
  other vias: 48.26,22.86
N$53  (via drill 1.1 pad 1.93)
  other vias: 45.72,22.86
N$54  (via drill 1.1 pad 1.93)
  other vias: 43.18,20.32
N$55  (via drill 1.1 pad 1.93)
  other vias: 45.72,20.32
N$56  (via drill 1.1 pad 1.93)
  other vias: 55.88,22.86
N$57  (via drill 1.1 pad 1.93)
  other vias: 53.34,22.86
N$58  (via drill 1.1 pad 1.93)
  other vias: 50.8,22.86
N$83  (via drill 1.1 pad 1.93)
  other vias: 48.26,20.32
N$84  (via drill 1.1 pad 1.93)
  other vias: 50.8,20.32
N$85  (via drill 1.1 pad 1.93)
  other vias: 53.34,20.32
N$86  (via drill 1.1 pad 1.93)
  other vias: 55.88,20.32
N$87  (via drill 1.1 pad 1.93)
  other vias: 43.18,17.78
N$88  (via drill 1.1 pad 1.93)
  other vias: 45.72,17.78
N$101  (via drill 1.1 pad 1.93)
  other vias: 48.26,17.78
N$102  (via drill 1.1 pad 1.93)
  other vias: 50.8,17.78
N$103  (via drill 1.1 pad 1.93)
  other vias: 53.34,17.78
N$104  (via drill 1.1 pad 1.93)
  other vias: 55.88,17.78
N$105  (via drill 1.1 pad 1.93)
  other vias: 55.88,15.24
N$106  (via drill 1.1 pad 1.93)
  other vias: 53.34,15.24
N$107  (via drill 1.1 pad 1.93)
  other vias: 50.8,15.24
N$108  (via drill 1.1 pad 1.93)
  other vias: 48.26,15.24
N$109  (via drill 1.1 pad 1.93)
  other vias: 45.72,15.24
N$110  (via drill 1.1 pad 1.93)
  other vias: 43.18,15.24
N$111  (via drill 1.1 pad 1.93)
  other vias: 43.18,22.86
N$112  (via drill 1.1 pad 1.93)
  other vias: 58.42,15.24
N$118  (via drill 1.1 pad 1.93)
  other vias: 40.64,30.48
N$119  (via drill 1.1 pad 1.93)
  other vias: 40.64,27.94
N$130  (via drill 1.1 pad 1.93)
  other vias: 53.34,30.48
N$131  (via drill 1.1 pad 1.93)
  other vias: 40.64,22.86
N$142  (via drill 1.1 pad 1.93)
  other vias: 40.64,20.32
N$143  (via drill 1.1 pad 1.93)
  other vias: 40.64,17.78
N$164  (via drill 1.1 pad 1.93)
  other vias: 40.64,15.24
N$165  (via drill 1.1 pad 1.93)
  other vias: 40.64,25.4
N$172  (via drill 1.1 pad 1.93)
  other vias: 38.1,30.48
N$173  (via drill 1.1 pad 1.93)
  other vias: 38.1,27.94
N$174  (via drill 1.1 pad 1.93)
  other vias: 38.1,25.4
N$175  (via drill 1.1 pad 1.93)
  other vias: 38.1,22.86
N$185  (via drill 1.1 pad 1.93)
  other vias: 38.1,20.32
N$186  (via drill 1.1 pad 1.93)
  other vias: 38.1,17.78
N$187  (via drill 1.1 pad 1.93)
  other vias: 38.1,15.24
N$188  (via drill 1.1 pad 1.93)
  other vias: 35.56,15.24
N$189  (via drill 1.1 pad 1.93)
  other vias: 35.56,17.78
N$190  (via drill 1.1 pad 1.93)
  other vias: 35.56,20.32
N$191  (via drill 1.1 pad 1.93)
  other vias: 35.56,22.86
N$192  (via drill 1.1 pad 1.93)
  other vias: 33.02,22.86
N$193  (via drill 1.1 pad 1.93)
  other vias: 33.02,20.32
N$194  (via drill 1.1 pad 1.93)
  other vias: 33.02,17.78
N$195  (via drill 1.1 pad 1.93)
  other vias: 33.02,15.24
N$196  (via drill 1.1 pad 1.93)
  other vias: 35.56,25.4
N$197  (via drill 1.1 pad 1.93)
  other vias: 35.56,30.48
N$198  (via drill 1.1 pad 1.93)
  other vias: 35.56,27.94
NC
  Top 0.406: JP3.8 M1.RESERVED
RED
  Top 0.254: X2.11 20.19,14.05 R1.2
RESET  (via drill 0.5)
  Top 0.254: SW2.B SW2.B' 10.19,5.68 v10.79,5.08
  Top 0.406: M1.RESET JP3.6
  Bottom 0.254: M1.RESET 33.02,3.56 32,4.57 15.88,4.57 15.37,5.08 v10.79,5.08
RESET_3V  (via drill 0.5)
  Top 0.254: U2.2 24.82,36.83 v23.62,36.83 | v10.67,12.57 10.11,13.13 X2.3
  Bottom 0.254: v23.62,36.83 24,36.83 27.69,33.15 27.69,14.48 24.51,11.3 19.18,11.3 18.03,12.45 10.79,12.45 v10.67,12.57
RX_3V  (via drill 0.5)
  Top 0.254: X2.34 12.65,32.85 13.46,33.66 v14.35,33.66 | U2.15 18.86,37.47 18.48,37.08 v18.41,37.08
  Bottom 0.254: v18.41,37.08 18.29,37.08 14.86,33.66 v14.35,33.66
SCK
  Top 0.254: JP10.1 28.19,42.42 28.19,42.95 26.69,44.45 26.42,44.45 23.24,44.45 22.61,45.09 U2.9
  Bottom 0.254: SJ3.2 61.72,22.86 61.72,36.96 64.77,40.01 64.77,47.88 64.39,48.26 35.43,48.26 35.31,48.13 35.31,40.51 35.05,40.26 30.35,40.26 JP10.1 SJ6.1
SCK_3V  (via drill 0.5)
  Top 0.254: X2.30 17.73,31.46 17.5,31.7 17.5,31.97 16.95,32.51 16.26,32.51 v15.62,33.15 | X1.5 6.41,42.8 v9.53,42.8 11.05,42.8 12.06,43.81 U2.10
  Bottom 0.254: v15.62,33.15 15.24,32.77 13.84,32.77 13.01,33.6 13.01,41.22 11.42,42.8 v9.53,42.8
SCK_ICSP
  Bottom 0.254: SJ3.1 66.42,20.32 67.56,21.46 67.56,28.83 67.18,29.21 64.9,29.21 M1.SCK
SCL  (via drill 0.5)
  Top 0.254: M1.SCL 18.8,48.51 | 18.8,48.51 JP5.1 | v4.95,50.16 5.21,49.91 ECC1.6 8.93,49.91 R7.1 10.07,51.05 11.56,51.05 14.1,48.51 18.8,48.51
SDA  (via drill 0.5)
  Top 0.254: JP5.2 M1.SDA | ECC1.5 R8.1 9.18,47.97 9.78,47.37 17.02,47.37 v17.06,47.33
  Bottom 0.254: JP5.2 20.12,45.77 17.86,45.77 17.06,46.56 v17.06,47.33
SDCS  (via drill 0.5)
  Top 0.254: v42.29,39.62 43.81,38.1 52.58,38.1 53.34,38.86 JP12.1 53.34,44.2 52.65,44.88 40.82,44.88 40.49,44.56 R4.7 | U2.11 21.21,42.55 v22.48,41.27
  Bottom 0.254: SD_JMP.2 JP12.1 | v42.29,39.62 41.78,39.12 28.18,39.12 26.91,40.39 22.99,40.39 22.48,40.89 v22.48,41.27
SDCS_3V
  Top 0.254: X1.2 6.8,39.5 10.03,39.5 11.81,41.27 U2.12
VIN
  Top 0.406: JP3.1 M1.VIN
VIOREF  (via drill 0.5)
  Top 0.254: R4.5 42.19,43.21 41.29,42.31 R4.3 R4.2 R4.1 38.77,41.82 35.94,38.99 30.88,38.99 v29.21,37.32
  Top 0.406: JP3.7 M1.IOREF
  Bottom 0.254: JP3.7 29.97,6.35 27.43,8.89 27.43,12.83 28.7,14.1 28.7,36.81 v29.21,37.32

### Text on the board
tPlace: CLK | MISO | MOSI | CS | BUSY | G0 | RST | SD | RX | TX | En | Adafruit AirLift WiFi Shield | 5.0V | GND | GND | 3.3V | RESET
bPlace: SPI via / 13/12/11 | SPI 2x3